# EAGLE design katotable_rev3.1 (EAGLE 9.6.2)
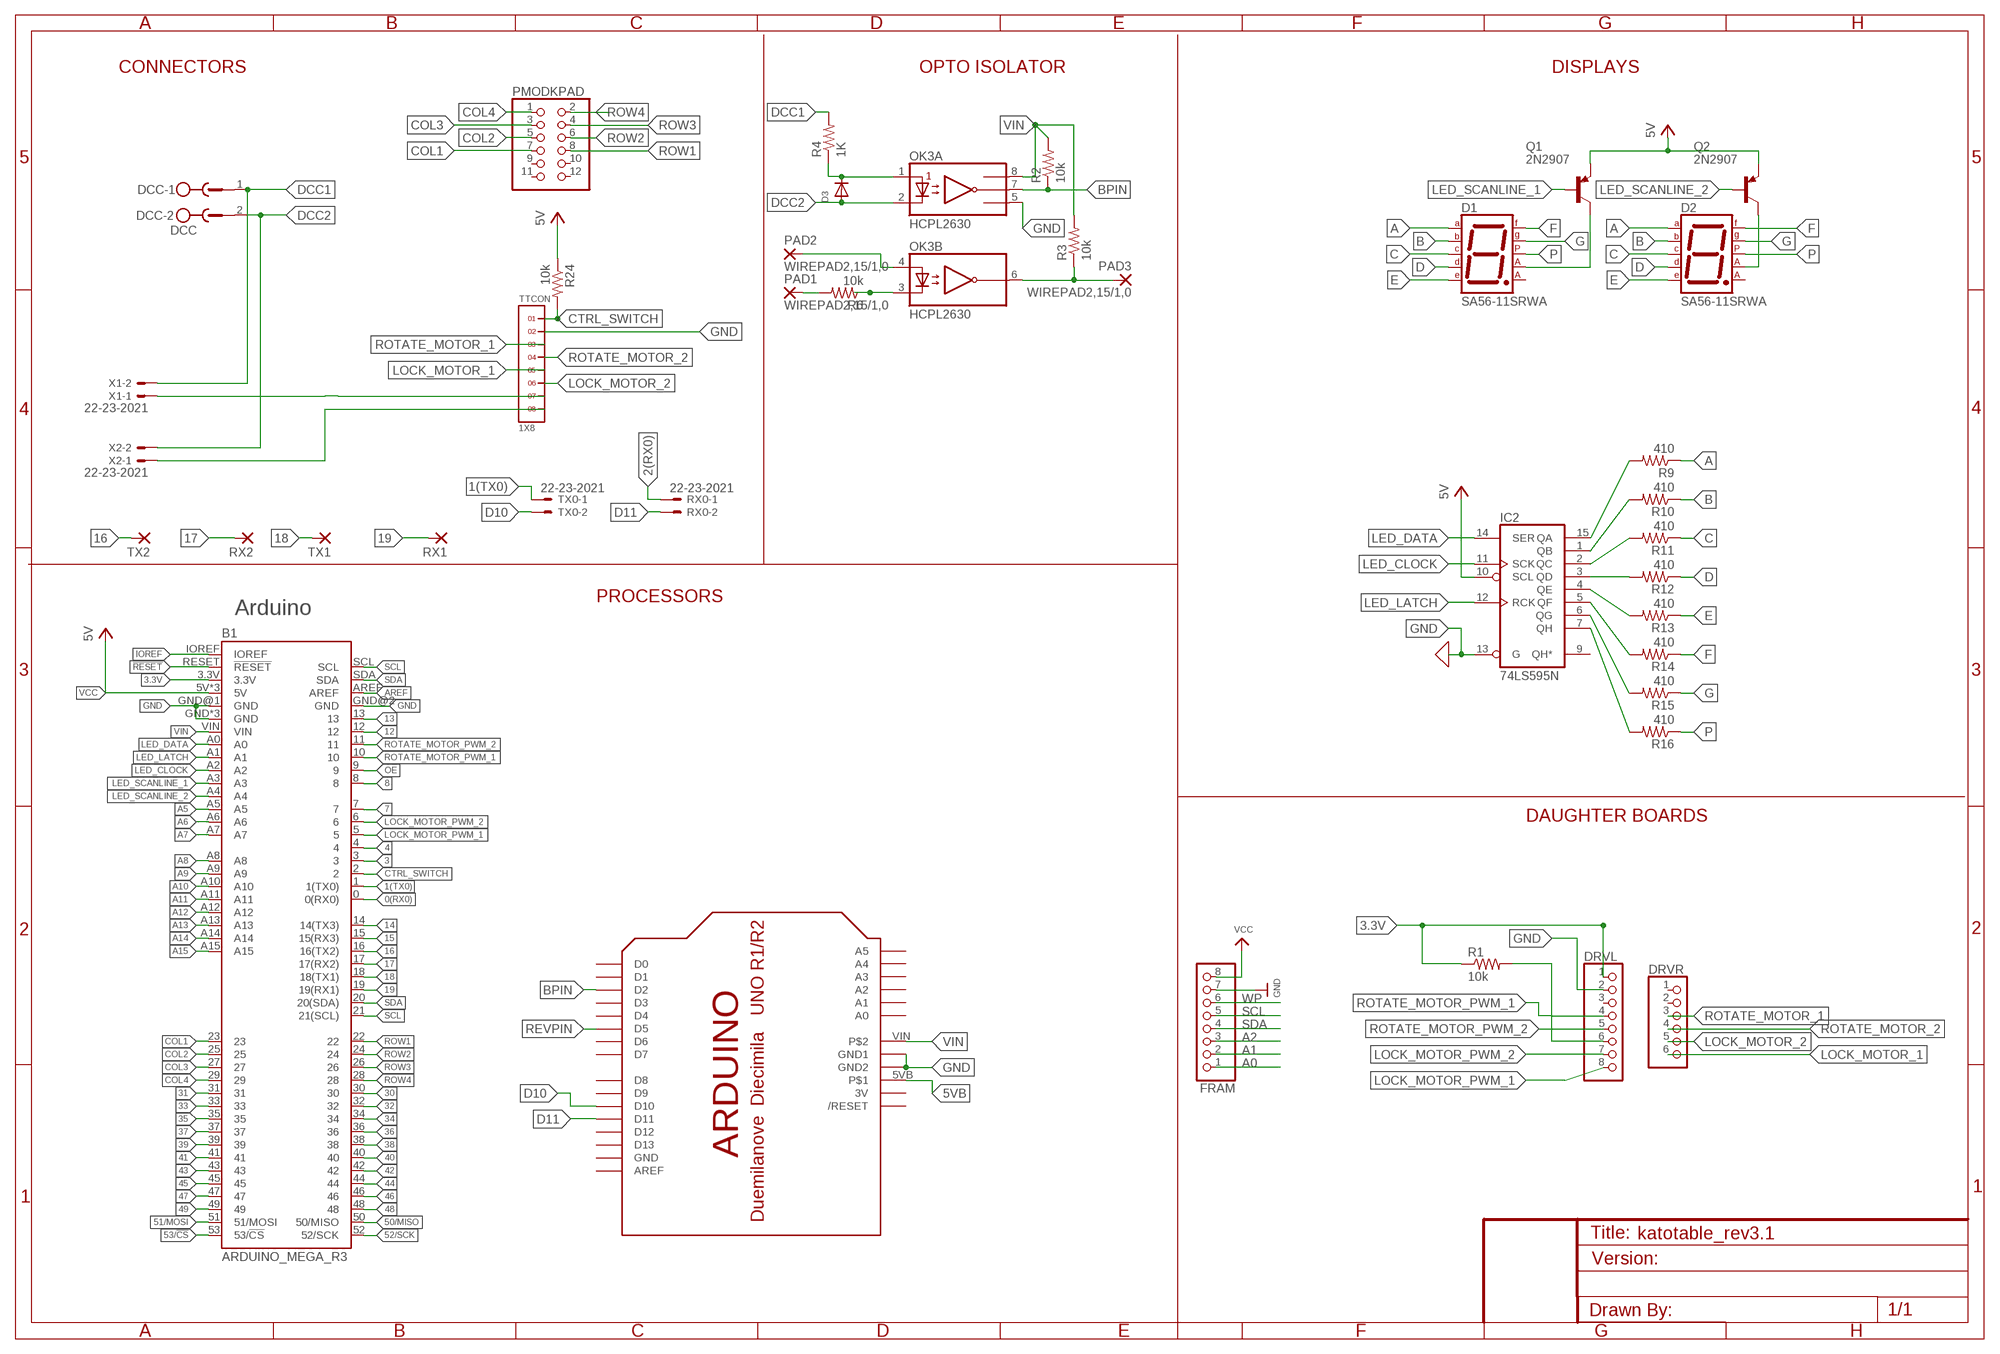
[diagram p0: schematic, sheet 1]

## Parts
B1  ARDUINO_MEGA_R3  ARDUINO_MEGA_R3FULL  [ARDUINO_MEGA_NO_SILK]
D1  SA56-11SRWA  7SEG-CA  [7SEG-13]
D2  SA56-11SRWA  7SEG-CA  [7SEG-13]
D3  DIODEDO-1N4148  [DO-1N4148]
DCC  DCC  MSTBV2  [MSTBV2]
DECODER  ARDUINO-BPLACE  [ARDUINO-BPLACE]
DRVL  PINHD-1X8  [1X08]
DRVR  PINHD-1X6  [1X06]
FRAM  HEADER-1X870MIL  [1X08_ROUND_70]
IC2  74LS595N  [DIL16]
OK3  HCPL2630  [DIL08]
PAD1  WIREPAD2,15/1,0  [2,15/1,0]
PAD2  WIREPAD2,15/1,0  [2,15/1,0]
PAD3  WIREPAD2,15/1,0  [2,15/1,0]
PMODKPAD  PINHD-2X6/90  [2X06/90]
Q1  2N2907  [TO18]
Q2  2N2907  [TO18]
R1  10k  R-US_0204/7  [0204/7]
R2  10k  R-US_0204/7  [0204/7]
R3  10k  R-US_0204/7  [0204/7]
R4  1K  R-US_0207/10  [0207/10]
R6  10k  R-US_0204/7  [0204/7]
R9  410  R-US_0204/7  [0204/7]
R10  410  R-US_0204/7  [0204/7]
R11  410  R-US_0204/7  [0204/7]
R12  410  R-US_0204/7  [0204/7]
R13  410  R-US_0204/7  [0204/7]
R14  410  R-US_0204/7  [0204/7]
R15  410  R-US_0204/7  [0204/7]
R16  410  R-US_0204/7  [0204/7]
R24  10k  R-US_0204/7  [0204/7]
RX0  22-23-2021  [22-23-2021]
RX1  WIREPAD2,54/1,0  [2,54/1,0]
RX2  WIREPAD2,54/1,0  [2,54/1,0]
TTCON  1X8  [1X8]
TX0  22-23-2021  [22-23-2021]
TX1  WIREPAD2,54/1,0  [2,54/1,0]
TX2  WIREPAD2,54/1,0  [2,54/1,0]
X1  22-23-2021  [22-23-2021]
X2  22-23-2021  [22-23-2021]

## Nets
0(RX0): B1.0(0(RX0))
1(TX0): B1.1(1(TX0)) TX0.1
2(RX0): RX0.1
3: B1.3
3.3V: B1.3.3V DRVL.1 R1.1
4: B1.4
5VB: DECODER.5VB
7: B1.7
8: B1.8
12: B1.12
13: B1.13
14: B1.14(14(TX3))
15: B1.15(15(RX3))
16: B1.16(16(TX2)) TX2.1(P)
17: B1.17(17(RX2)) RX2.1(P)
18: B1.18(18(TX1)) TX1.1(P)
19: B1.19(19(RX1)) RX1.1(P)
30: B1.30
31: B1.31
32: B1.32
33: B1.33
34: B1.34
35: B1.35
36: B1.36
37: B1.37
38: B1.38
39: B1.39
40: B1.40
41: B1.41
42: B1.42
43: B1.43
44: B1.44
45: B1.45
46: B1.46
47: B1.47
48: B1.48
49: B1.49
50/MISO: B1.50(50/MISO)
51/MOSI: B1.51(51/MOSI)
52/SCK: B1.52(52/SCK)
53/!CS: B1.53(53/!CS)
!RESET: B1.RESET(!RESET)
A: D1.7(A) D2.7(A) R9.1
A0: FRAM.1
A1: FRAM.2
A2: FRAM.3
A5: B1.A5
A6: B1.A6
A7: B1.A7
A8: B1.A8
A9: B1.A9
A10: B1.A10
A11: B1.A11
A12: B1.A12
A13: B1.A13
A14: B1.A14
A15: B1.A15
AREF: B1.AREF
B: D1.6(B) D2.6(B) R10.1
BPIN: DECODER.D2 OK3.7(A:VO1) R2.1
C: D1.4(C) D2.4(C) R11.1
COL1: B1.23 PMODKPAD.7
COL2: B1.25 PMODKPAD.5
COL3: B1.27 PMODKPAD.3
COL4: B1.29 PMODKPAD.1
COM: OK3.4(B:A2) PAD2.1(P)
CTRL_SWITCH: B1.2 R24.2 TTCON.1
D: D1.2(D) D2.2(D) R12.1
D10: DECODER.D10 TX0.2
D11: DECODER.D11 RX0.2
DCC1: DCC.1 R4.2 X1.2
DCC2: D3.A DCC.2 OK3.2(A:C1) X2.2
E: D1.1(E) D2.1(E) R13.1
F: D1.9(F) D2.9(F) R14.1
G: D1.10(G) D2.10(G) R15.1
GND [vcc]: B1.GND B1.GND@1(GND) B1.GND@2(GND) B1.GND@3(GND) B1.GND@4(GND) DECODER.GND1 DECODER.GND2 DRVL.2 FRAM.7 IC2.13(G) OK3.5(A:GND) TTCON.2
IOREF: B1.IOREF
LED_CLOCK: B1.A2 IC2.11(SCK)
LED_DATA: B1.A0 IC2.14(SER)
LED_LATCH: B1.A1 IC2.12(RCK)
LED_SCANLINE_1: B1.A3 Q1.2(B)
LED_SCANLINE_2: B1.A4 Q2.2(B)
LOCK_MOTOR_1: DRVR.6 TTCON.5
LOCK_MOTOR_2: DRVR.5 TTCON.6
LOCK_MOTOR_PWM_1: B1.5 DRVL.8
LOCK_MOTOR_PWM_2: B1.6 DRVL.7
N$1: D3.C OK3.1(A:A1) R4.1
N$2: DRVL.6 R1.2
N$3: PAD1.1(P) R6.2
N$4: OK3.3(B:C2) R6.1
N$5: TTCON.7 X1.1
N$6: TTCON.8 X2.1
N$17: IC2.15(QA) R9.2
N$18: IC2.1(QB) R10.2
N$19: IC2.2(QC) R11.2
N$20: IC2.3(QD) R12.2
N$21: IC2.4(QE) R13.2
N$22: IC2.5(QF) R14.2
N$23: IC2.6(QG) R15.2
N$24: IC2.7(QH) R16.2
N$33: D1.3(CA1) Q1.3(C)
N$46: D2.3(CA1) Q2.3(C)
OE: B1.9
P: D1.5(DP) D2.5(DP) R16.1
REVPIN: DECODER.D5 OK3.6(B:VO2) PAD3.1(P) R3.1
ROTATE_MOTOR_1: DRVR.3 TTCON.3
ROTATE_MOTOR_2: DRVR.4 TTCON.4
ROTATE_MOTOR_PWM_1: B1.10 DRVL.4
ROTATE_MOTOR_PWM_2: B1.11 DRVL.5
ROW1: B1.22 PMODKPAD.8
ROW2: B1.24 PMODKPAD.6
ROW3: B1.26 PMODKPAD.4
ROW4: B1.28 PMODKPAD.2
SCL: B1.21(21(SCL)) B1.SCL FRAM.5
SDA: B1.20(20(SDA)) B1.SDA FRAM.4
VCC: B1.5V B1.5V@1(5V) B1.5V@2(5V) FRAM.8 IC2.10(SCL) Q1.1(E) Q2.1(E) R24.1 ; supply symbol labelled 5V
VIN [vcc]: B1.VIN DECODER.VIN OK3.8(A:VCC) R2.2 R3.2
WP: FRAM.6
Unconnected: D1.8(CA2) D2.8(CA2) DECODER.A0 DECODER.A1 DECODER.A2 DECODER.A3 DECODER.A4 DECODER.A5 DECODER.AREF DECODER.D0 DECODER.D1 DECODER.D3 DECODER.D4 DECODER.D6 DECODER.D7 DECODER.D8 DECODER.D9 DECODER.D12 DECODER.D13 DECODER.RESET(/RESET) DRVL.3 DRVR.1 DRVR.2 IC2.9(QH*) PMODKPAD.9 PMODKPAD.10 PMODKPAD.11 PMODKPAD.12

## Notes on the sheet
- CONNECTORS | OPTO ISOLATOR | DISPLAYS
- PROCESSORS
- Arduino
- DAUGHTER BOARDS

## Power pins joined to a net without a drawn wire
3V: DECODER.3V
GND: DECODER.GND IC2.8(GND)
VCC: IC2.16(VCC)

## Library data of the parts
B1 = SparkFun-Boards:ARDUINO_MEGA_R3: Arduino Mega R3 ATmega2560 R3 compatible footprint. SparkFun Products: Arduino Mega 2560 R3 <https://www.sparkfun.com/products/11061>
D1 D2 = special:7SEG-CA: 7-segment DISPLAY single anode, 13 mm
D3 = adafruit:DIODE: Diode SMADIODE - SMA Surface Mount Package 20V 1A Schottky Diode Digikey: 641-1014-6-ND DO-1N4148 - Through Hole Small Current Diode SOD-123 20V 1 A (.5mV Vf) Schottky Diode - Digikey: MBRX120TPMSCT-ND SOD-323 10V 570mA (.38mV Vf, 3ns) Schottky Diode - Digikey: ZLLS410CT-ND SOD-523 30V 30mA Schottky Diode (RB751S-40TE61) - Digikey: RB751S-40TE61CT-ND SOT23-R/W - SOT23 Package (R = Solder Paste/Reflow Ovens, W = Hand-Soldering) BAT54Film 40V 300mA - Digikey: 497-7162-1-ND
DCC = con-phoenix-500:MSTBV2: PHOENIX; OC_FARNELL: unknown; OC_NEWARK: unknown
DECODER = adafruit_mod:ARDUINO: Arduino Diecimila/Duemilanove Make a shield with ease, this package has all the named pins as well as the two mounting drill holes and an outline of the USB and DC power connector. The outline is on the DIMENSION layer, so if your board house uses it they will cut the outline to match. http://www.ladyada.net/library/pcb/eaglelibrary.html
DRVL = pinhead:PINHD-1X8: PIN HEADER
DRVR = pinhead:PINHD-1X6: PIN HEADER
FRAM = microbuilder:HEADER-1X8: PIN HEADER
IC2 = 74xx-us:74*595: 8-bit SHIFT REGISTER, output latch
OK3 = optocoupler:HCPL2630: HEWLETT PACKARD OPTO COUPLER; MF: AGILENT TECHNOLOGIES; MPN: HCPL-2630-000E; OC_FARNELL: 9994904; OC_NEWARK: 88H7813
PAD1-PAD3 RX1 RX2 TX1 TX2 = wirepad:WIREPAD: Wire PAD connect wire on PCB
PMODKPAD = pinhead:PINHD-2X6: PIN HEADER
Q1 Q2 = transistor-pnp:2N2907*: PNP Transistor
R1-R3 R6 R9-R16 R24 = rcl:R-US_: RESISTOR, American symbol; SPICEPREFIX: R
R4 = adafruit:R-US_: RESISTOR, American symbol
RX0 TX0 X1 X2 = con-molex:22-23-2021: .100" (2.54mm) Center Header - 2 Pin; MF: MOLEX; MPN: 22-23-2021; OC_FARNELL: 1462926; OC_NEWARK: 25C3832
TTCON = headers(2mm):1X8

## Net classes
0 Default: width 0.5 mm, clearance 0.5 mm
1 vcc: width 0.5 mm, clearance 0.5 mm

## Board
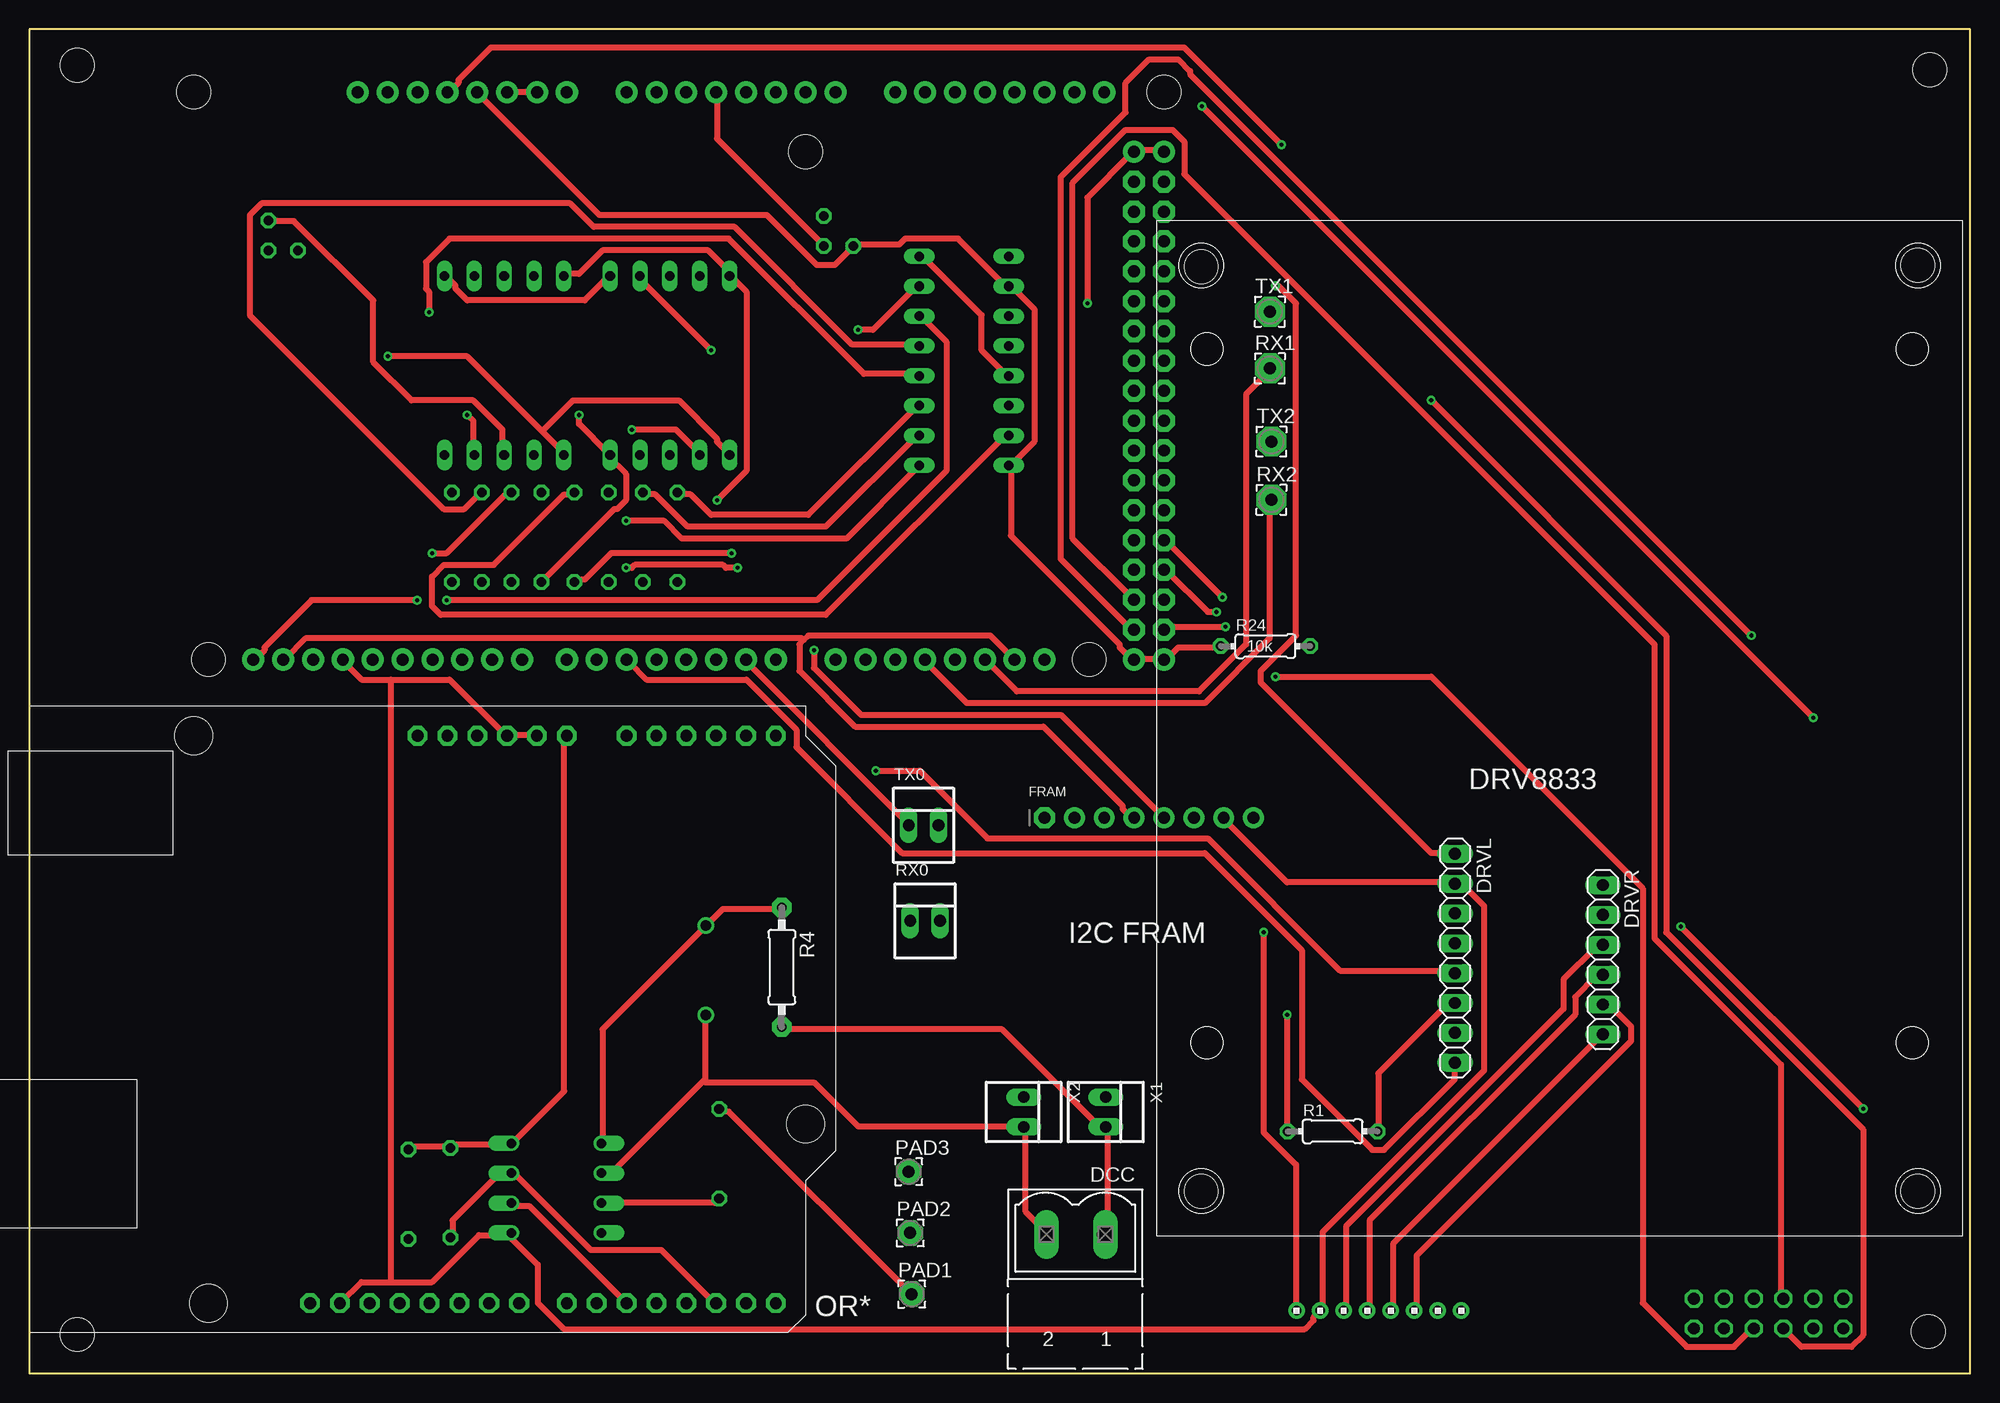
[diagram p1: board, top side]
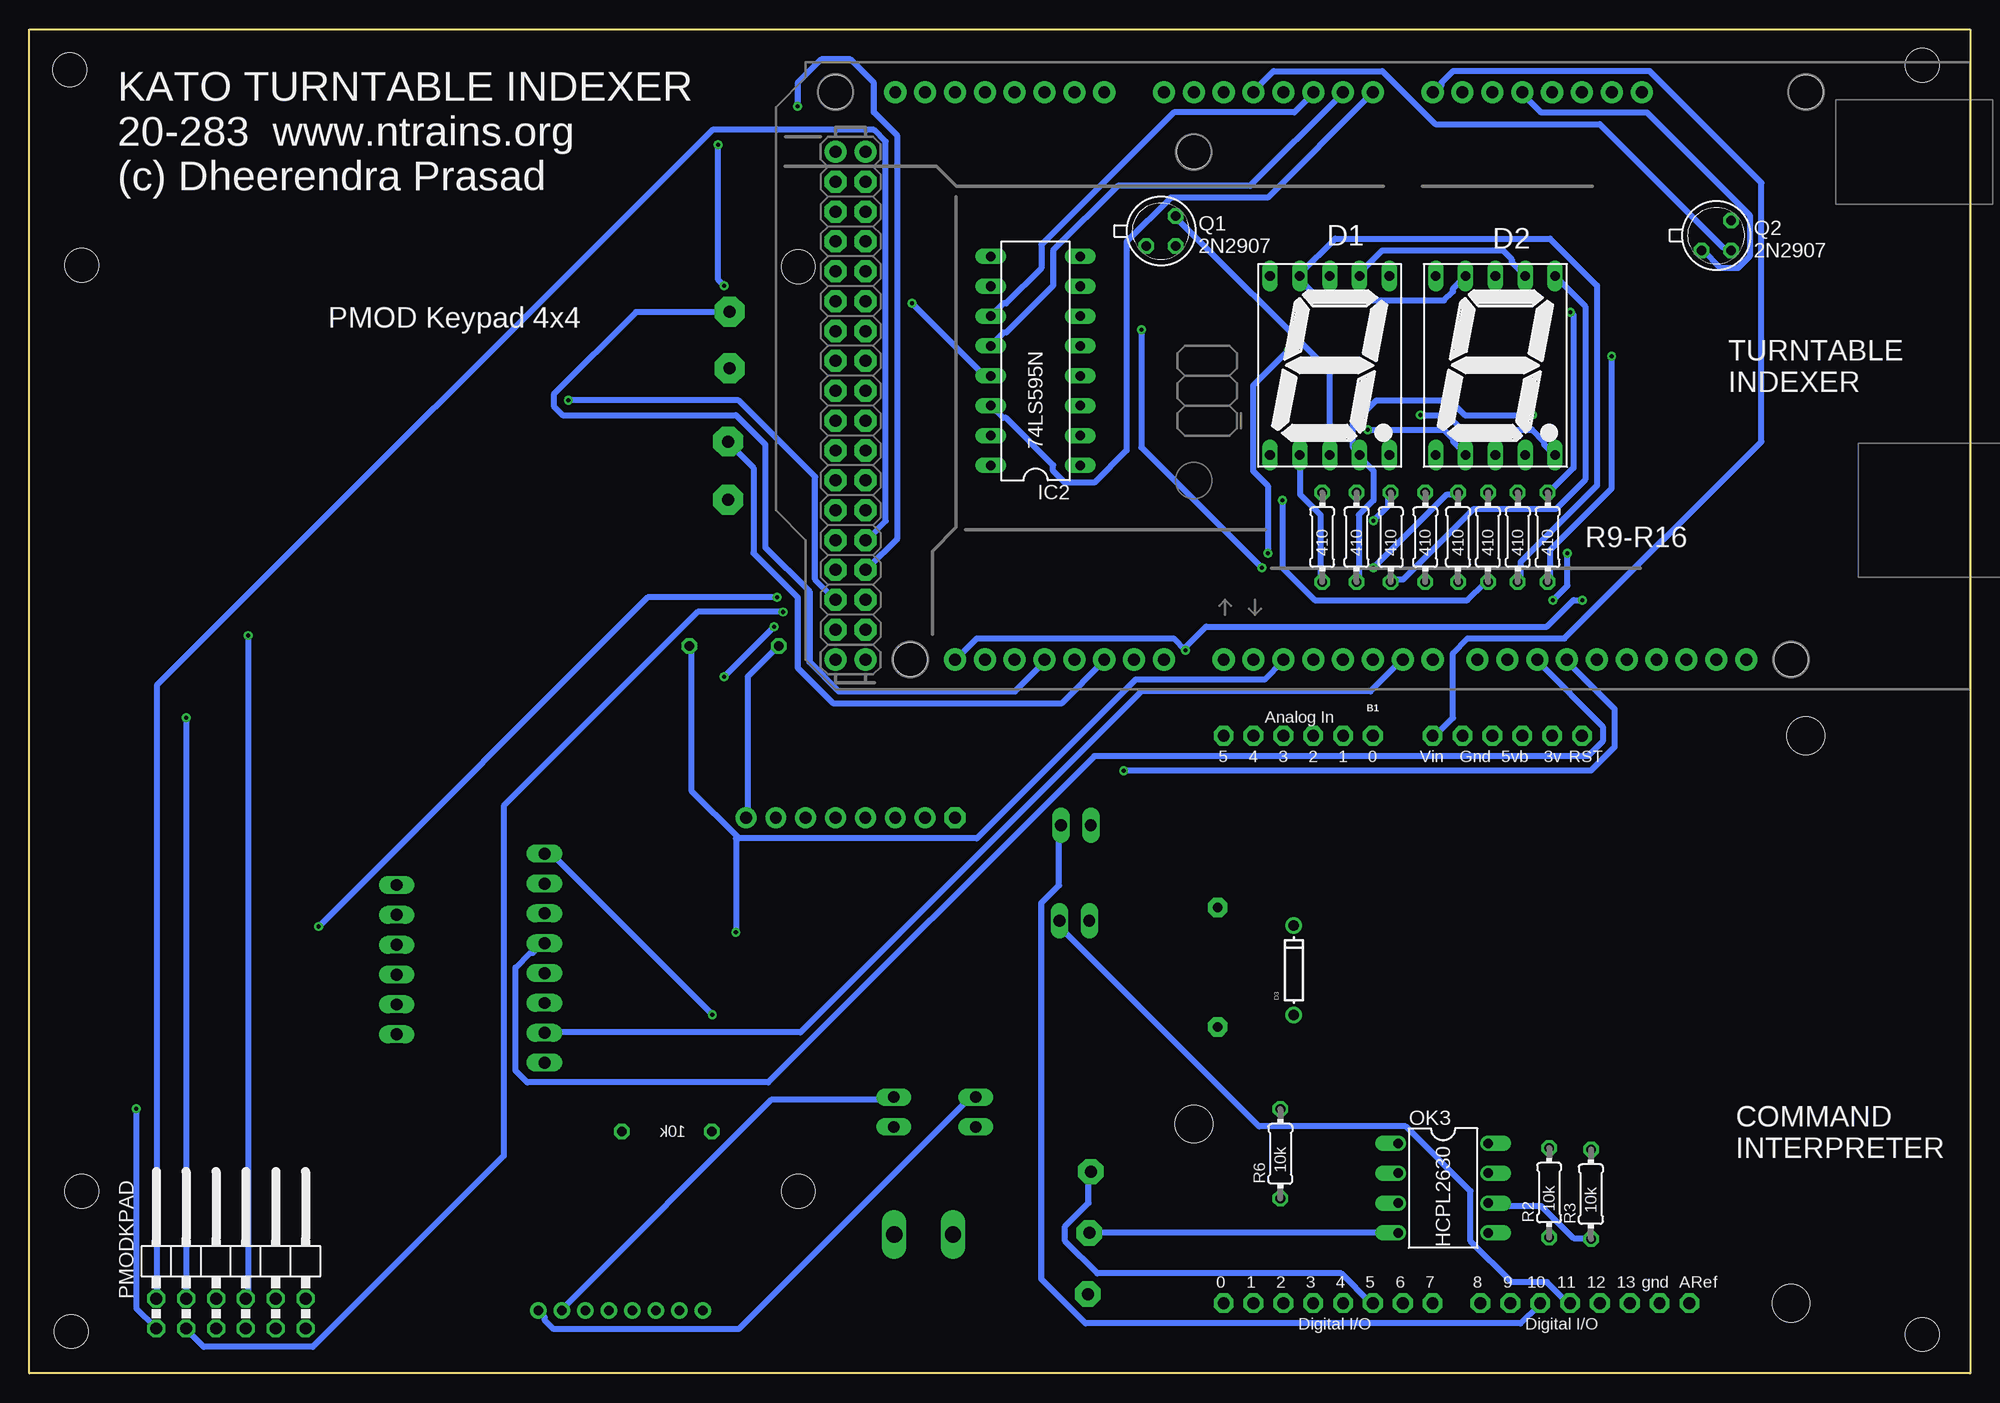
[diagram p2: board, bottom side, seen from below]

Size 165.1 x 114.3 mm. Coordinates in mm from the lower left corner, seen from the top.
Outline: 0,0 165.1,0 165.1,114.3 0,114.3 0,0
Copper layers (1*16): Top 0.035mm / dielectric 1.5mm / Bottom 0.035mm
Design rules "katotable": minimum track width 10mil, minimum drill 0.35mm, track to track 10mil, track to pad 10mil, pad to pad 10mil, via to via 10mil, smd to smd 6mil, copper to edge 40mil, drill to drill 6mil, minimum pad ring 10mil, minimum via ring 8mil, stop-mask expansion 4mil, vias tented up to drill 0mil, thermal gap 10mil
Holes 2.86 mm at 15.24,60.71 13.97,108.97 66.04,103.89 96.52,108.97 90.17,60.71 160.66,94.23 160.66,15.49 99.69,15.49 99.69,94.11 161.67,110.87 4.06,111.25 4.06,3.3 161.54,3.56

### Footprints (pad centres in the part's own frame; a part is rotated, then mirrored left to right if it is on the bottom)
ARDUINO_MEGA_NO_SILK = drill 1.016 pad 1.88: 0 13.97,24.13; 1 11.43,24.13; 2 8.89,24.13; 3 6.35,24.13; 3.3V -13.97,-24.13; 4 3.81,24.13; 5 1.27,24.13; 5V -11.43,-24.13; 5V@1 44.45,24.13; 5V@2 46.99,24.13; 6 -1.27,24.13; 7 -3.81,24.13; 8 -7.62,24.13; 9 -10.16,24.13; 10 -12.7,24.13; 11 -15.24,24.13; 12 -17.78,24.13; 13 -20.32,24.13; 14 19.05,24.13; 15 21.59,24.13; 16 24.13,24.13; 17 26.67,24.13; 18 29.21,24.13; 19 31.75,24.13; 20 34.29,24.13; 21 36.83,24.13; A0 1.27,-24.13; A1 3.81,-24.13; A2 6.35,-24.13; A3 8.89,-24.13; A4 11.43,-24.13; A5 13.97,-24.13; A6 16.51,-24.13; A7 19.05,-24.13; A8 24.13,-24.13; A9 26.67,-24.13; A10 29.21,-24.13; A11 31.75,-24.13; A12 34.29,-24.13; A13 36.83,-24.13; A14 39.37,-24.13; A15 41.91,-24.13; AREF -25.4,24.13; GND -8.89,-24.13; GND@1 -6.35,-24.13; GND@2 44.45,-19.05; GND@3 46.99,-19.05; GND@4 -22.86,24.13; IOREF -19.05,-24.13; NC -21.59,-24.13; RESET -16.51,-24.13; SCL -30.48,24.13; SDA -27.94,24.13; VIN -3.81,-24.13 | drill 1.016 pad 1.88 octagon: 22 44.45,21.59; 23 46.99,21.59; 24 44.45,19.05; 25 46.99,19.05; 26 44.45,16.51; 27 46.99,16.51; 28 44.45,13.97; 29 46.99,13.97; 30 44.45,11.43; 31 46.99,11.43; 32 44.45,8.89; 33 46.99,8.89; 34 44.45,6.35; 35 46.99,6.35; 36 44.45,3.81; 37 46.99,3.81; 38 44.45,1.27; 39 46.99,1.27; 40 44.45,-1.27; 41 46.99,-1.27; 42 44.45,-3.81; 43 46.99,-3.81; 44 44.45,-6.35; 45 46.99,-6.35; 46 44.45,-8.89; 47 46.99,-8.89; 48 44.45,-11.43; 49 46.99,-11.43; 50 44.45,-13.97; 51 46.99,-13.97; 52 44.45,-16.51; 53 46.99,-16.51
7SEG-13 = drill 0.813 long: 1 -5.08,-7.62; 2 -2.54,-7.62; 3 0,-7.62; 4 2.54,-7.62; 5 5.08,-7.62; 6 5.08,7.62; 7 2.54,7.62; 8 0,7.62; 9 -2.54,7.62; 10 -5.08,7.62
DO-1N4148 = drill 0.9: A -3.81,0; C 3.81,0
MSTBV2 = drill 1.397 long: 1 -2.5,0; 2 2.5,0
ARDUINO-BPLACE = drill 1 pad 1.676 octagon: 3V 35.56,2.54; 5VB 38.1,2.54; A0 50.8,2.54; A1 53.34,2.54; A2 55.88,2.54; A3 58.42,2.54; A4 60.96,2.54; A5 63.5,2.54; AREF 23.876,50.8; D0 63.5,50.8; D1 60.96,50.8; D2 58.42,50.8; D3 55.88,50.8; D4 53.34,50.8; D5 50.8,50.8; D6 48.26,50.8; D7 45.72,50.8; D8 41.656,50.8; D9 39.116,50.8; D10 36.576,50.8; D11 34.036,50.8; D12 31.496,50.8; D13 28.956,50.8; GND 26.416,50.8; GND1 43.18,2.54; GND2 40.64,2.54; RESET 33.02,2.54; VIN 45.72,2.54 | hole 3.2: 15.24,50.8; 66.04,35.56; 13.97,2.54
1X08 = drill 1.016 long: 1 -8.89,0; 2 -6.35,0; 3 -3.81,0; 4 -1.27,0; 5 1.27,0; 6 3.81,0; 7 6.35,0; 8 8.89,0
1X06 = drill 1.016 long: 1 -6.35,0; 2 -3.81,0; 3 -1.27,0; 4 1.27,0; 5 3.81,0; 6 6.35,0
1X08_ROUND_70 = drill 1 pad 1.778 octagon: 1 -8.89,0 | drill 1 pad 1.778: 2 -6.35,0; 3 -3.81,0; 4 -1.27,0; 5 1.27,0; 6 3.81,0; 7 6.35,0; 8 8.89,0
DIL16 = drill 0.813 long: 1 -8.89,-3.81; 2 -6.35,-3.81; 3 -3.81,-3.81; 4 -1.27,-3.81; 5 1.27,-3.81; 6 3.81,-3.81; 7 6.35,-3.81; 8 8.89,-3.81; 9 8.89,3.81; 10 6.35,3.81; 11 3.81,3.81; 12 1.27,3.81; 13 -1.27,3.81; 14 -3.81,3.81; 15 -6.35,3.81; 16 -8.89,3.81
DIL08 = drill 0.813 offset: 1 -3.81,-3.81; 2 -1.27,-3.81; 3 1.27,-3.81; 4 3.81,-3.81; 5 3.81,3.81; 6 1.27,3.81; 7 -1.27,3.81; 8 -3.81,3.81
2,15/1,0 = drill 1.016 pad 2.159 octagon: 1 0,0
2X06/90 = drill 1.016 octagon: 1 -6.35,-6.35; 2 -6.35,-3.81; 3 -3.81,-6.35; 4 -3.81,-3.81; 5 -1.27,-6.35; 6 -1.27,-3.81; 7 1.27,-6.35; 8 1.27,-3.81; 9 3.81,-6.35; 10 3.81,-3.81; 11 6.35,-6.35; 12 6.35,-3.81
TO18 = drill 0.813 octagon: 1 -1.27,-1.27; 2 1.27,-1.27; 3 1.27,1.27
0204/7 = drill 0.813 octagon: 1 -3.81,0; 2 3.81,0
0207/10 = drill 0.813 pad 1.676 octagon: 1 -5.08,0; 2 5.08,0
22-23-2021 = drill 1 long: 1 -1.27,0; 2 1.27,0
2,54/1,0 = drill 1.016 pad 2.54 octagon: 1 0,0
1X8 = drill 0.8 pad 1.422: 1 -7,0; 2 -5,0; 3 -3,0; 4 -1,0; 5 1,0; 6 3,0; 7 5,0; 8 7,0

### Placement (x,y rotation side)
B1  49.53,84.84 180 bottom
D1  54.48,85.72 0 bottom
D2  40.39,85.72 0 bottom
D3  57.53,34.29 90 bottom
DCC  89.03,11.81 180 top
DECODER  0,56.77 180 bottom
DRVL  121.28,35.31 270 top
DRVR  133.86,35.18 270 top
FRAM  95.25,47.24 0 top
IC2  79.5,86.11 90 bottom
OK3  44.83,15.75 270 bottom
PAD1  75.06,6.73 0 top
PAD2  74.93,11.94 0 top
PAD3  74.8,17.14 0 top
PMODKPAD  147.96,10.16 0 bottom
Q1  68.83,97.16 0 bottom
Q2  21.59,96.77 0 bottom
R1  110.87,20.57 0 top
R2  35.81,15.37 90 bottom
R3  32.26,15.24 90 bottom
R4  64.01,34.54 270 top
R6  58.67,18.67 90 bottom
R9  46.35,71.12 90 bottom
R10  49.28,71.12 90 bottom
R11  52.2,71.12 90 bottom
R12  55.12,71.12 90 bottom
R13  35.94,71.12 90 bottom
R14  38.48,71.12 90 bottom
R15  41.02,71.12 90 bottom
R16  43.56,71.12 90 bottom
R24  105.16,61.85 0 top
RX0  76.2,38.48 0 top
RX1  105.54,85.47 0 top
RX2  105.66,74.3 0 top
TTCON  114.81,5.33 0 top
TX0  76.07,46.61 0 top
TX1  105.54,90.3 0 top
TX2  105.66,79.25 0 top
X1  91.57,22.23 270 top
X2  84.58,22.23 270 top

### Tracks (layer width: path | path; a pad name or v marks a point on that pad's centre or on a via)
1(TX0)
  Top 0.5: TX0.1 74.75,46.75 61,60.5 B1.1
3.3V  (via drill 0.35)
  Top 0.5: v107,30.5 107,20.75 R1.1 | v106.5,104.5 98.25,112.75 39.25,112.75 36.5,110 36.5,109.75 35.75,109 B1.3.3V | v106,92.5 106.25,92.5 107.75,91 107.75,62.75 104.75,59.75 104.75,58.75 119.25,44.25 121.25,44.25 DRVL.1
  Bottom 0.5: v107,30.5 120.5,44 121.25,44 DRVL.1 | v106.5,104.5 106.5,93 v106,92.5
16
  Bottom 0.5: B1.16 73.75,60.5 77.25,57 96.75,57 99.75,60 99.75,66 103.5,69.75 103.5,77 105.5,79 TX2.1
17
  Top 0.5: B1.17 76.25,60.5 79.75,57 100,57 105.5,62.5 105.5,74.25 RX2.1
18
  Bottom 0.5: B1.18 78.75,60.5 81.25,58 96.25,58 98.75,60.5 98.75,66.5 102.5,70.25 102.5,79 105,81.5 119.75,81.5 120.5,82.25 120.5,83.25 113.5,90.25 105.75,90.25 TX1.1
19
  Top 0.5: B1.19 81.5,60.5 84,58 99.5,58 103.5,62 103.5,83.25 105.5,85.25 RX1.1
A  (via drill 0.35)
  Top 0.5: v59.75,69.75 49.5,69.75 47.25,67.5 46.5,67.5 R9.1 | v58,87 51.75,93.25 D1.7
  Bottom 0.5: D2.7 38,93.5 39,94.5 39,94.75 39.75,95.5 50,95.5 52,93.5 D1.7 | v59.75,69.75 59.75,75.5 61,76.75 61,84 v58,87
B
  Top 0.5: D2.6 35.5,93.25 36.25,92.5 36.25,92.25 37.25,91.25 47.25,91.25 49.25,93.25 D1.6
  Bottom 0.5: R10.1 49.25,67.5 48.25,67.5 42.25,73.5 35.25,73.5 32.75,76 32.75,90.75 35.25,93.25 D2.6
BPIN
  Top 0.5: R2.1 36,11.75 36,13 40,17 41,17 OK3.7 41.25,17 47.75,10.5 53.75,10.5 58.25,6 DECODER.D2
C  (via drill 0.35)
  Top 0.5: v37.25,81.5 37.75,81 37.75,78.25 D2.4
  Bottom 0.5: R11.1 52,67.5 52,73 50.75,74.25 50.75,76.75 52,78 D1.4 52,78.25 52.5,78.75 52.5,80.75 50.5,82.75 44.25,82.75 43,81.5 v37.25,81.5
COL1  (via drill 0.35)
  Top 0.5: v106,59.25 119.25,59.25 137.25,41.25 137.25,6 141,2.25 145,2.25 146.5,3.75 PMODKPAD.7 | v101.75,63.5 97,63.5 96.75,63.25 B1.23
  Bottom 0.5: v101.75,63.5 v106,59.25
COL2  (via drill 0.35)
  Top 0.5: v119.25,82.75 139.25,62.75 139.25,37.5 156,20.75 156,3.25 155,2.25 150.75,2.25 149.25,3.75 PMODKPAD.5
  Bottom 0.5: v119.25,82.75 104.75,82.75 98.25,76.25 98.25,67.5 96.75,66 B1.25
COL3  (via drill 0.35)
  Top 0.5: v101,64.75 100.25,64.75 96.75,68.25 B1.27
  Bottom 0.5: v101,64.75 108.25,64.75 124.75,48.25 124.75,18.5 141,2.25 150.25,2.25 151.75,3.75 PMODKPAD.3
COL4  (via drill 0.35)
  Top 0.5: v140.5,38 v156,22.5 | v101.5,66 96.75,70.75 B1.29
  Bottom 0.5: v156,22.5 156,5.5 154.5,4 PMODKPAD.1 | v140.5,38 112.5,66 v101.5,66
COM
  Bottom 0.5: OK3.4 48.75,12 74.75,12 PAD2.1
CTRL_SWITCH  (via drill 0.35)
  Top 0.5: v105,37.5 105,20.5 107.75,17.75 107.75,5.5 TTCON.1
  Bottom 0.5: 104.88,45.62 104.75,45.5 84.5,45.5 71,59 60,59 58.5,60.5 B1.2 | 104.88,45.62 108.75,49.5 108.75,61.75 R24.2 | v105,37.5 105,45.5 104.88,45.62
D  (via drill 0.35)
  Top 0.5: v51.25,80.25 55,80.25 57,78.25 D1.2
  Bottom 0.5: R12.1 55.25,67.5 55.25,73 57,74.75 57,78 D1.2 | v51.25,80.25 44.75,80.25 44,79.5 44,79.25 43,78.25 D2.2
D10
  Bottom 0.5: TX0.2 77.5,46.5 77.5,41.5 79,40 79,8 75.25,4.25 38.25,4.25 36.75,5.75 DECODER.D10
D11
  Bottom 0.5: RX0.2 77.25,38.25 77.25,37.75 60.5,21 48,21 42.5,15.5 42.5,11.25 39,7.75 36,7.75 34.25,6 DECODER.D11
DCC1
  Top 0.5: DCC.1 91.75,12 91.75,20.75 X1.2 91.5,21 91,21 82.75,29.25 64.25,29.25 R4.2
DCC2
  Top 0.5: DCC.2 86.5,12 84.75,13.75 84.75,20.75 X2.2 84.5,21 70.5,21 66.75,24.75 57.5,24.75 57.38,24.88 | 57.38,24.88 57.5,25 57.5,30.25 D3.A | 57.38,24.88 49.75,17.25 48.75,17.25 OK3.2
E  (via drill 0.35)
  Top 0.5: v30.5,86.5 37.25,86.5 43.62,80.12 | 43.62,80.12 45.5,78.25 D2.1 | 43.62,80.12 46.25,82.75 55.25,82.75 58.5,79.5 58.5,79.25 59.5,78.25 D1.1
  Bottom 0.5: v30.5,86.5 30.5,75.25 35.75,70 35.75,67.5 R13.1
F
  Bottom 0.5: R14.1 38.25,67.5 38.25,69 31.75,75.5 31.75,92.5 35.75,96.5 54,96.5 57,93.5 D1.9 57.25,93.25 55.25,91.25 44.75,91.25 44,92 44,92.25 43,93.25 D2.9
G  (via drill 0.35)
  Top 0.5: v58.5,74.25 61,76.75 61,92 59.75,93.25 D1.10 59.75,93.5 57.75,95.5 48.75,95.5 46.75,93.5 45.5,93.5 D2.10
  Bottom 0.5: v58.5,74.25 58.5,68.5 55.75,65.75 42.75,65.75 41.25,67.25 R15.1
GND  (via drill 0.35)
  Top 0.5: FRAM.7 101.75,47 107,41.75 121.25,41.75 DRVL.2 121.5,41.5 122,41.5 123.75,39.75 123.75,25.75 110,12 110,5.5 TTCON.2 109.75,5.25 109.25,4.75 109.25,4.5 108.5,3.75 45.5,3.75 43.25,6 43.25,9.25 41,11.5 OK3.5 41,11.75 38.25,11.75 34.25,7.75 30.75,7.75 | 30.75,7.75 28.25,7.75 26.5,6 DECODER.GND | IC2.8 75.75,94.75 76.25,94.75 81,90 81,87 83.25,84.75 IC2.13 | DECODER.GND1 43,54.25 40.75,54.25 DECODER.GND2 40.5,54.25 35.75,59 30.75,59 | B1.GND@1 43,109 40.75,109 B1.GND | B1.GND@3 96.5,104 94,104 B1.GND@2 93.75,103.75 90,100 v90,91 | 30.75,59 28.25,59 26.75,60.5 B1.GND@4 | 30.75,59 30.75,7.75
  Bottom 0.5: v90,91 84,85 83.5,85 IC2.13
LED_CLOCK
  Bottom 0.5: IC2.11 83.25,90 82.25,91 82,91 79,94 79,96 67.75,107.25 57.5,107.25 56,108.75 B1.A2
LED_DATA
  Bottom 0.5: IC2.14 83.25,82.25 82.25,81.25 82,81.25 78,77.25 78,76.75 77,75.75 74.5,75.75 71.75,78.5 71.75,96.25 68,100 59.75,100 51,108.75 B1.A0
LED_LATCH
  Bottom 0.5: IC2.12 83.25,87.5 82.25,88.5 82,88.5 78,92.5 78,95.5 72.5,101 61.25,101 53.5,108.75 B1.A1
LED_SCANLINE_1
  Top 0.5: Q1.2 67.5,96 58.5,105 58.5,108.75 B1.A3
LED_SCANLINE_2
  Bottom 0.5: Q2.2 20.5,95.75 21,95.75 31.5,106.25 45.5,106.25 50,110.75 59.25,110.75 61,109 B1.A4
LOCK_MOTOR_1
  Top 0.5: TTCON.5 116,5.5 116,11 133.75,28.75 DRVR.6
LOCK_MOTOR_2
  Top 0.5: TTCON.6 118,5.5 118,10 136.25,28.25 136.25,29.5 134.5,31.25 134,31.25 DRVR.5
LOCK_MOTOR_PWM_1
  Top 0.5: DRVL.8 121.25,26.25 121.25,25 115.25,19 114.25,19 108.25,25 108.25,36 100,44.25 74.25,44.25 65.25,53.25 65.25,54.75 61,59 52.5,59 51,60.5 B1.5
LOCK_MOTOR_PWM_2
  Bottom 0.5: DRVL.7 121.25,29 99.5,29 70.5,58 51,58 48.5,60.5 B1.6
N$1
  Top 0.5: OK3.1 48.75,19.75 48.75,29.25 57.5,38 D3.C 57.75,38.25 59,39.5 64,39.5 R4.1
N$2
  Top 0.5: R1.2 114.75,20.75 114.75,25.5 120.5,31.25 121.25,31.25 DRVL.6
N$3
  Top 0.5: R6.2 58.75,22.25 59.5,22.25 75,6.75 PAD1.1
N$4
  Top 0.5: OK3.3 48.75,14.5 58.25,14.5 58.5,14.75 R6.1
N$5
  Bottom 0.5: TTCON.7 119.75,5.5 102,23.25 91.75,23.25 X1.1
N$6
  Bottom 0.5: TTCON.8 121.75,5.25 121.25,4.75 121.25,4.5 120.5,3.75 104.75,3.75 85.25,23.25 84.75,23.25 X2.1
N$17
  Top 0.5: R9.2 46.25,74.75 45.5,74.75 39.5,68.75 35.25,68.75 34.25,67.75 34.25,65.25 35,64.5 67.75,64.5 83.25,80 IC2.15
N$18  (via drill 0.35)
  Top 0.5: v50.75,72.5 54,72.5 55.5,71 69.5,71 75.5,77 IC2.1
  Bottom 0.5: v50.75,72.5 49.5,73.75 49.5,74.75 R10.2
N$19
  Top 0.5: R11.2 52.25,74.75 53.25,74.75 56,72 67.75,72 75.5,79.75 IC2.2
N$20
  Top 0.5: R12.2 55.25,74.75 56.25,74.75 58,73 66.25,73 75.5,82.25 IC2.3
N$21  (via drill 0.35)
  Top 0.5: v34,90.25 34,92 33.75,92.25 33.75,94.5 35.75,96.5 59.5,96.5 71,85 75.5,85 IC2.4
  Bottom 0.5: v34,90.25 33.75,90 33.75,77 35.75,75 R13.2
N$22
  Top 0.5: R14.2 38.25,74.75 37,73.5 35.25,73.5 18.75,90 18.75,98.5 19.75,99.5 46,99.5 48,97.5 60,97.5 70,87.5 75.5,87.5 IC2.5
N$23  (via drill 0.35)
  Top 0.5: v34.25,69.75 35.5,69.75 40.5,74.75 41,74.75 R15.2 | v35.5,65.75 67,65.75 78,76.75 78,87.75 75.75,90 IC2.6
  Bottom 0.5: v34.25,69.75 34.25,67 v35.5,65.75
N$24  (via drill 0.35)
  Top 0.5: v50.75,68.5 51.25,68.5 51.5,68.75 59,68.75 59.25,68.5 v60.25,68.5 | v70.5,88.75 71.75,88.75 75.5,92.5 IC2.7
  Bottom 0.5: v50.75,68.5 44.5,74.75 43.75,74.75 R16.2 | v60.25,68.5 70.5,78.75 v70.5,88.75
N$33
  Bottom 0.5: D1.3 54.5,78.25 54.5,85.25 67.5,98.25 Q1.3
N$46
  Top 0.5: Q2.3 20.5,98 22.5,98 29.25,91.25 29.25,86 32.5,82.75 37.75,82.75 40.25,80.25 40.25,78.25 D2.3
P  (via drill 0.35)
  Top 0.5: R16.1 43.75,67.5 49.75,73.5 50,73.5 50.75,74.25 50.75,76.5 49.25,78 D1.5 49.25,78.25 46.75,80.75 v46.75,81.5
  Bottom 0.5: v46.75,81.5 44.5,81.5 43.25,80.25 37.25,80.25 36.25,79.25 36.25,79 35.5,78.25 D2.5
REVPIN
  Top 0.5: DECODER.D5 50.75,6 42.5,14.25 41.25,14.25 OK3.6
  Bottom 0.5: R3.1 32.5,11.5 33.75,11.5 36.5,14.25 41,14.25 OK3.6 | PAD3.1 75,17 75,14.5 77,12.5 77,11.25 74.25,8.5 53.5,8.5 51,6 DECODER.D5
ROTATE_MOTOR_1
  Top 0.5: TTCON.3 112,5.5 112,12.5 130.5,31 130.5,33.5 133.25,36.25 133.75,36.25 DRVR.3
ROTATE_MOTOR_2
  Top 0.5: TTCON.4 114,5.5 114,13 131.5,30.5 131.5,32 133.25,33.75 133.75,33.75 DRVR.4
ROTATE_MOTOR_PWM_1
  Bottom 0.5: DRVL.4 121.5,36.5 122.25,35.75 122.5,35.75 123.75,34.5 123.75,25.75 122.75,24.75 102.25,24.75 74.5,52.5 32.5,52.5 31.25,53.75 31.25,55 36.75,60.5 B1.10
ROTATE_MOTOR_PWM_2  (via drill 0.35)
  Top 0.5: v72,51.25 75.75,51.25 81.5,45.5 100.25,45.5 111.5,34.25 121.25,34.25 DRVL.5
  Bottom 0.5: v72,51.25 32.25,51.25 30.25,53.25 30.25,56.5 34.25,60.5 B1.11
ROW1  (via drill 0.35)
  Top 0.5: v146.5,62.75 98.75,110.5 98.75,110.75 97.75,111.75 95.25,111.75 93.25,109.75 93.25,107.25 87.75,101.75 87.75,69.25 93.75,63.25 B1.22
  Bottom 0.5: v146.5,62.75 146.5,6.5 PMODKPAD.8
ROW2
  Top 0.5: PMODKPAD.6 149,6.5 149,26.25 138.25,37 138.25,62 98.25,102 98.25,104.75 97.25,105.75 93.25,105.75 88.75,101.25 88.75,71 93.75,66 B1.24
ROW3  (via drill 0.35)
  Top 0.5: v99.75,107.75 v151.75,55.75
  Bottom 0.5: v151.75,55.75 151.75,6.5 PMODKPAD.4 | v99.75,107.75 99.75,109.75 97.75,111.75 95.25,111.75 93.25,109.75 93.25,107.25 91.25,105.25 91.25,71 93.75,68.5 B1.26
ROW4
  Bottom 0.5: PMODKPAD.2 154.25,6.5 154.25,58.5 107,105.75 93.25,105.75 92.25,104.75 92.25,72.5 93.75,71 B1.28
SCL  (via drill 0.35)
  Top 0.5: v66.75,61.5 66.75,60 70.75,56 87.75,56 96.5,47.25 FRAM.5 | v33,65.75 24,65.75 20,61.75 20,61.5 19.25,60.75 B1.SCL
  Bottom 0.5: B1.21 86.25,60.75 84.5,62.5 67.75,62.5 v66.75,61.5 66.75,61.75 65,63.5 36,63.5 33.75,65.75 v33,65.75
SDA
  Top 0.5: 65.88,62.38 66.25,62.75 81.75,62.75 83.75,60.75 B1.20 | 65.88,62.38 65.5,62 65.5,59.75 70.25,55 86.25,55 93,48.25 93,48 93.75,47.25 FRAM.4 | B1.SDA 21.75,60.75 23.5,62.5 65.75,62.5 65.88,62.38
VCC
  Top 0.5: R24.1 101.25,61.75 97.75,61.75 96.75,60.75 B1.5V@2 96.5,60.75 94,60.75 B1.5V@1 93.75,60.75 92.75,61.75 92.75,62 83.5,71.25 83.5,77 IC2.16 83.5,77.25 85.5,79.25 85.5,90.5 83.5,92.5 IC2.10 83.25,92.25 79,96.5 74.5,96.5 74,96 70.25,96 Q1.1 70,95.75 68.5,94.25 67,94.25 62.75,98.5 48.5,98.5 38.25,108.75 B1.5V
  Bottom 0.5: Q2.1 22.75,95.5 21.25,94 19.75,94 18.75,95 18.75,98.5 27.5,107.25 36.5,107.25 38,108.75 B1.5V | FRAM.8 104,47.25 104,59.25 101.5,61.75 R24.1
VIN
  Top 0.5: R3.2 32.5,19.25 35.75,19.25 R2.2 35.75,19.5 41,19.5 OK3.8 41.25,19.75 45.5,24 45.5,54 DECODER.VIN
  Bottom 0.5: B1.VIN 45.5,109 45,109.5 45,109.75 44,110.75 27.25,110.75 17.75,101.25 17.75,79.25 34.5,62.5 42.75,62.5 44,61.25 44,55.75 45.5,54.25 DECODER.VIN

### Text on the board
tPlace: DRV8833 | I2C FRAM | OR*
bPlace: KATO TURNTABLE INDEXER / 20-283 www.ntrains.org / (c) Dheerendra Prasad | PMOD Keypad 4x4 | TURNTABLE / INDEXER | R9-R16 | COMMAND / INTERPRETER